# EAGLE design FTDI_PROG2 (EAGLE 5.10)
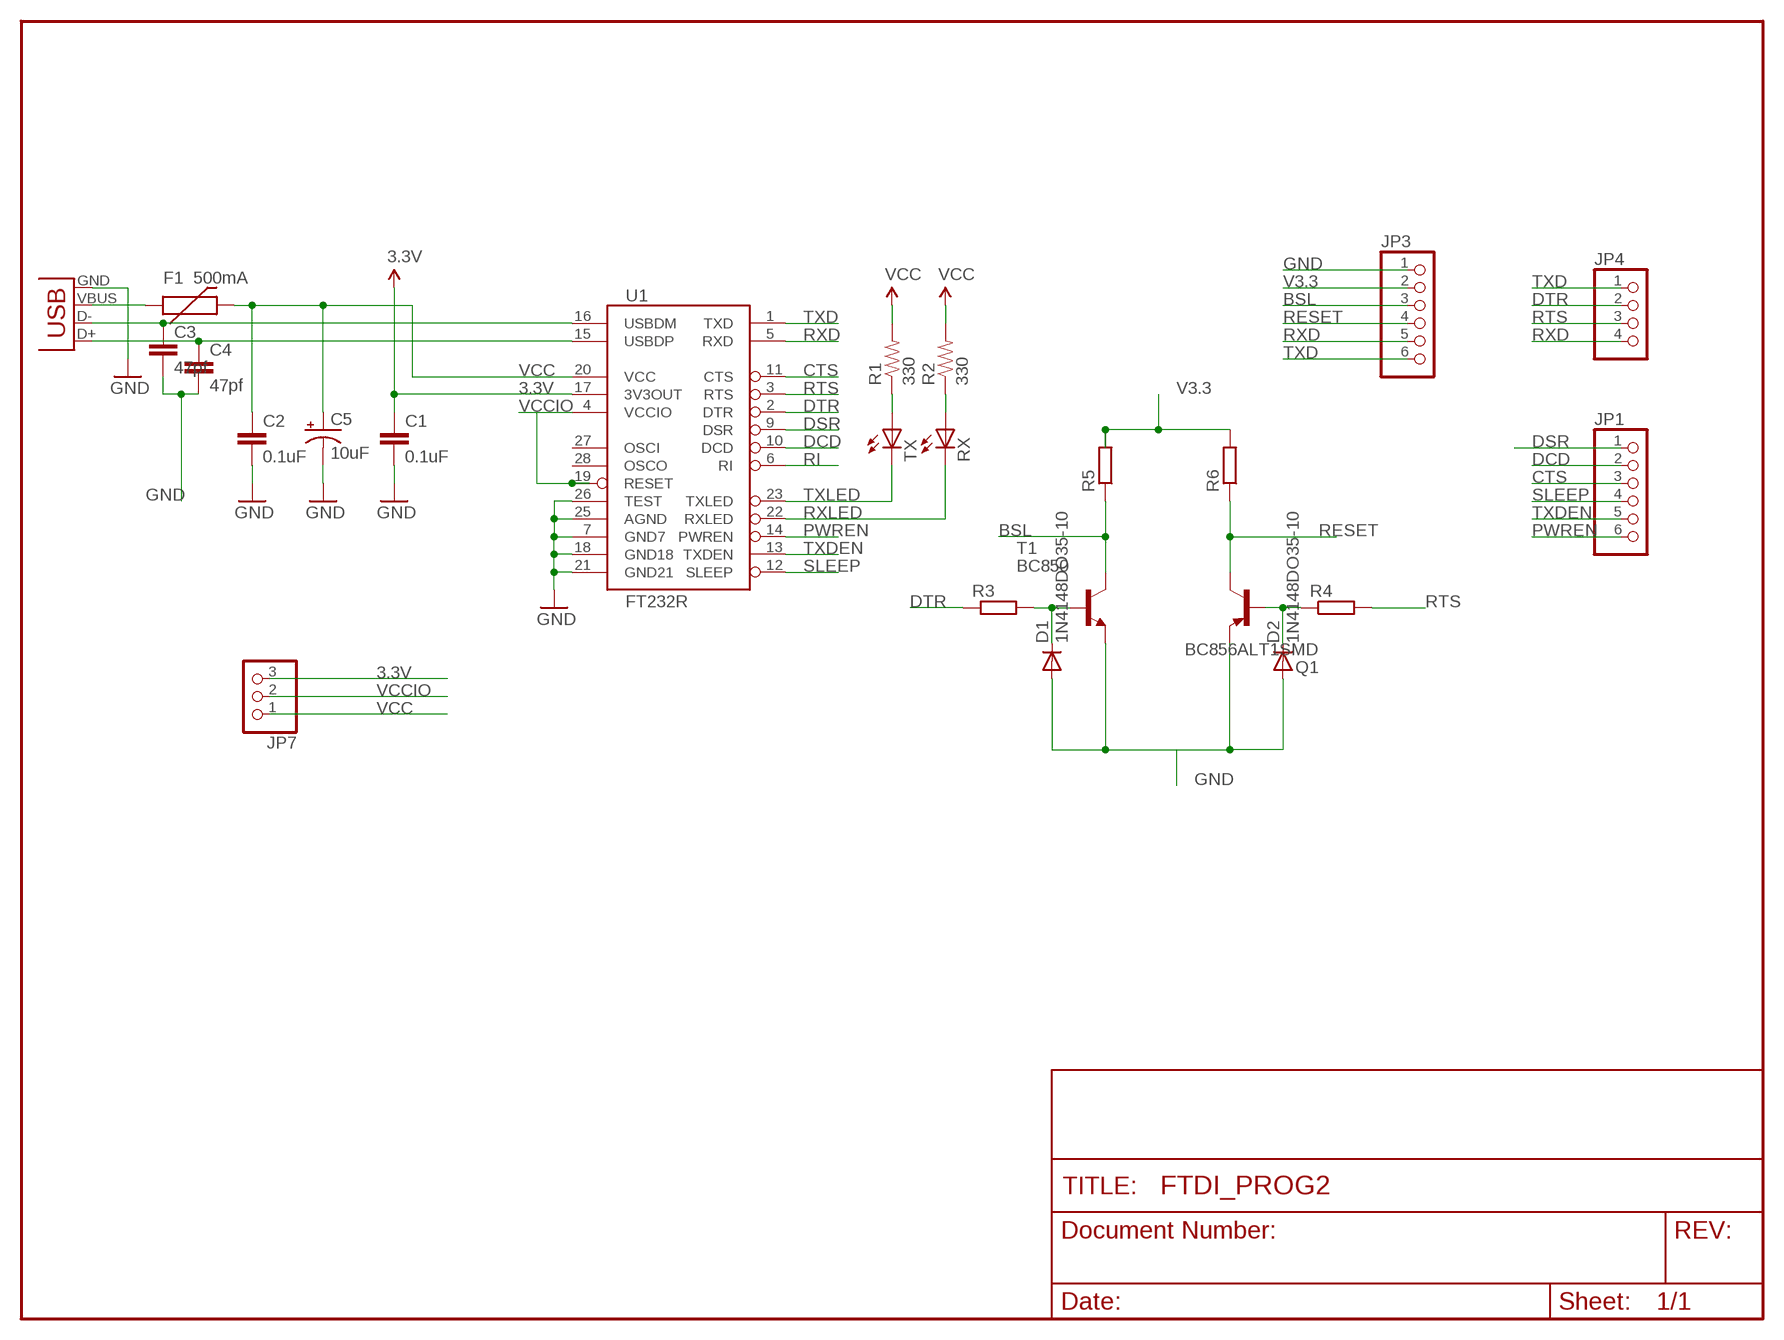
[diagram p0: schematic, sheet 1]

## Parts
C1  0.1uF  CAP1206  [1206]
C2  0.1uF  CAP1206  [1206]
C3  47pf  C-EU025-024X044  [C025-024X044]
C4  47pf  C-EU025-025X050  [C025-025X050]
C5  10uF  CAP_POLPTH1  [CPOL-RADIAL-100UF-25V]
D1  1N4148DO35-10  [DO35-10]
D2  1N4148DO35-10  [DO35-10]
F1  500mA  PTCSMD  [PTC-1206]
JP1  PINHD-1X6  [1X06]
JP3  PINHD-1X6  [1X06]
JP4  PINHD-1X4  [1X04]
JP7  PINHD-1X3  [1X03]
Q1  BC856ALT1SMD  [SOT23-BEC]
R1  330  RESISTOR1206  [1206]
R2  330  RESISTOR1206  [1206]
R3  R-EU_0207/10  [0207/10]
R4  R-EU_0207/10  [0207/10]
R5  R-EU_0207/10  [0207/10]
R6  R-EU_0207/10  [0207/10]
RX  LED1206  [LED-1206]
T1  BC850  [SOT23]
TX  LED1206  [LED-1206]
U1  FT232R  FT232RLSSOP  [SSOP28DB]
X2  USBPTH  [USB-B-PTH]

## Nets
3.3V [power]: C1.1 JP7.3 U1.17(3V3OUT)
BSL: JP3.3 R5.1 T1.3(C)
CTS: JP1.3 U1.11(CTS)
DCD: JP1.2 U1.10(DCD)
DSR: JP1.1 U1.9(DSR)
DTR: JP4.2 R3.1 U1.2(DTR)
GND [power]: C1.2 C2.2 C3.2 C4.2 C5.2(-) D1.A D2.A JP3.1 Q1.E T1.2(E) U1.7(GND7) U1.18(GND18) U1.21(GND21) U1.25(AGND) U1.26(TEST) X2.GND
N$1: R1.1 TX.A
N$2: R2.1 RX.A
N$3: F1.1 X2.VBUS
N$4: D1.C R3.2 T1.1(B)
N$5: D2.C Q1.B R4.1
PWREN: JP1.6 U1.14(PWREN)
RESET: JP3.4 Q1.C R6.1
RI: U1.6(RI)
RTS: JP4.3 R4.2 U1.3(RTS)
RXD: JP3.5 JP4.4 U1.5(RXD)
RXLED: RX.C U1.22(RXLED)
SLEEP: JP1.4 U1.12(SLEEP)
TXD: JP3.6 JP4.1 U1.1(TXD)
TXDEN: JP1.5 U1.13(TXDEN)
TXLED: TX.C U1.23(TXLED)
USB_D+: C4.1 U1.15(USBDP) X2.D+
USB_D-: C3.1 U1.16(USBDM) X2.D-
V3.3: JP3.2 R5.2 R6.2
VCC [power]: C2.1 C5.1(+) F1.2 JP7.1 R1.2 R2.2 U1.20(VCC)
VCCIO: JP7.2 U1.4(VCCIO) U1.19(RESET)
Unconnected: U1.27(OSCI) U1.28(OSCO)

## Library data of the parts
C1 C2 = SparkFun:CAP: Capacitor Standard 0603 ceramic capacitor, and 0.1" leaded capacitor.
C3 C4 = rcl:C-EU: CAPACITOR, European symbol
C5 = SparkFun:CAP_POL: Capacitor Polarized These are standard SMD and PTH capacitors. Normally 10uF, 47uF, and 100uF in electrolytic and tantalum varieties. Always verify the external diameter of the through hole cap, it varies with capacity, voltage, and manufacturer. The EIA devices should be standard.
D1 D2 = diode:1N4148: DIODE high speed (Philips)
F1 = SparkFun:PTC: Resettable Fuse PTC Resettable Fuse. Spark Fun Electronics SKU : COM-08357
JP1 JP3 = pinhead:PINHD-1X6: PIN HEADER
JP4 = pinhead:PINHD-1X4: PIN HEADER
JP7 = pinhead:PINHD-1X3: PIN HEADER
Q1 = transistor-pnp:BC856*: PNP Transistror
R1 R2 = SparkFun:RESISTOR: Resistor Basic schematic elements and footprints for 0603, 1206, and PTH 1/10th watt (small) resistors.
R3-R6 = resistor:R-EU_: RESISTOR, European symbol
RX TX = SparkFun:LED: LEDs Standard schematic elements and footprints for 5mm, 3mm, 1206, and 0603 sized LEDs. 5mm - Spark Fun Electronics SKU : COM-00529 (and others)
T1 = transistor:BC850: NPN TRANSISTOR
U1 = SparkFun:FT232RL: USB UART FT232RL 4th Generation USB UART (USB <-> Serial) Controller. Spark Fun Electronics SKU : COM-00650
X2 = SparkFun:USB: USB Connectors USB-B-PTH is fully proven SKU : PRT-00139 USB-miniB is fully proven SKU : PRT-00587 USB-A-PCB is untested. USB-A-H is throughly reviewed, but untested. Spark Fun Electronics SKU : PRT-00437 USB-B-SMT is throughly reviewed, but untested. Needs silkscreen touching up. USB-A-S has not been used/tested USB-MB-H has not been used/tested

## Net classes
0 default: width 0.203 mm
1 power: width 0.254 mm

## Board
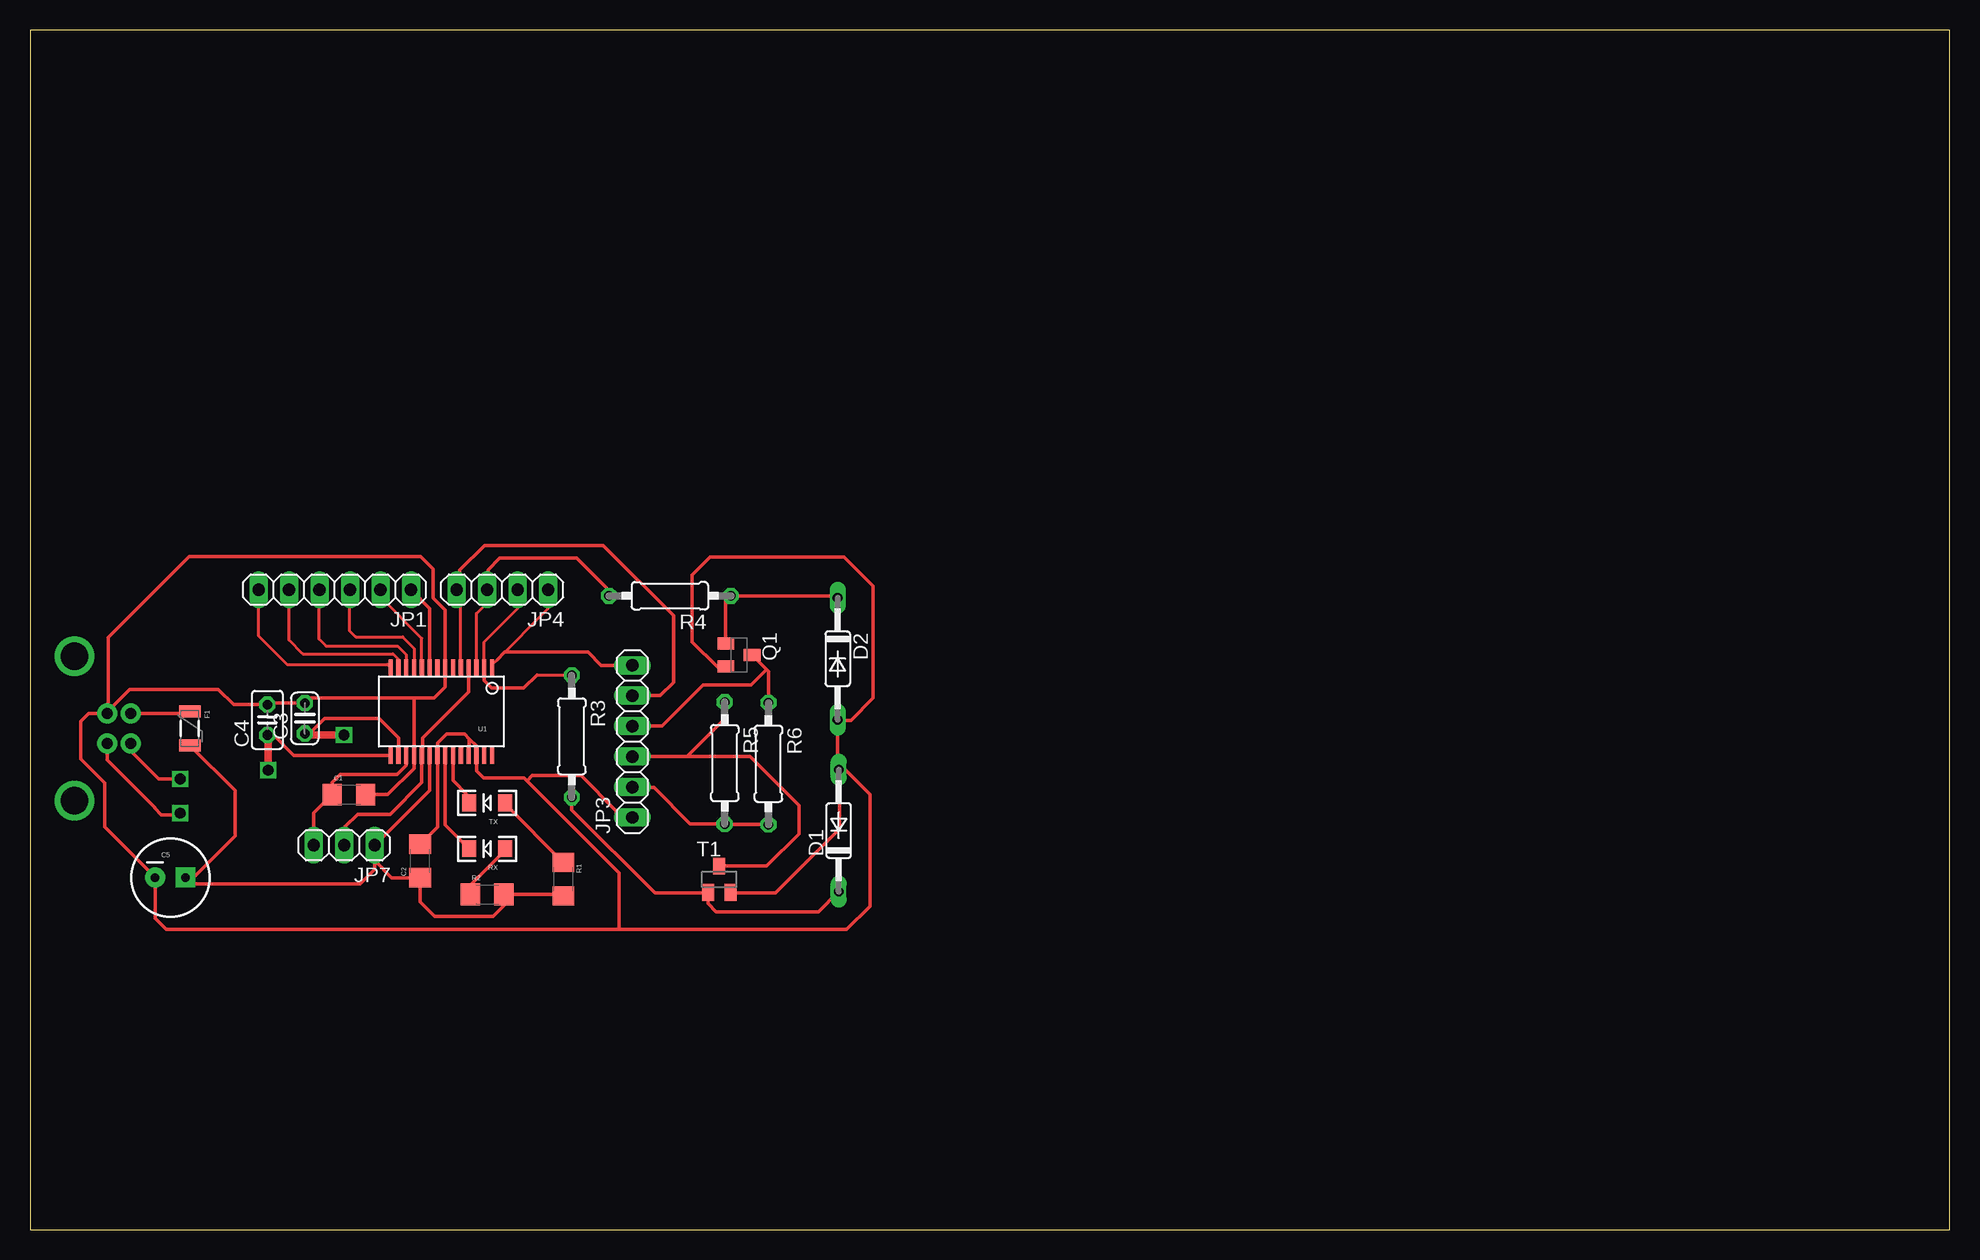
[diagram p1: board, top side]
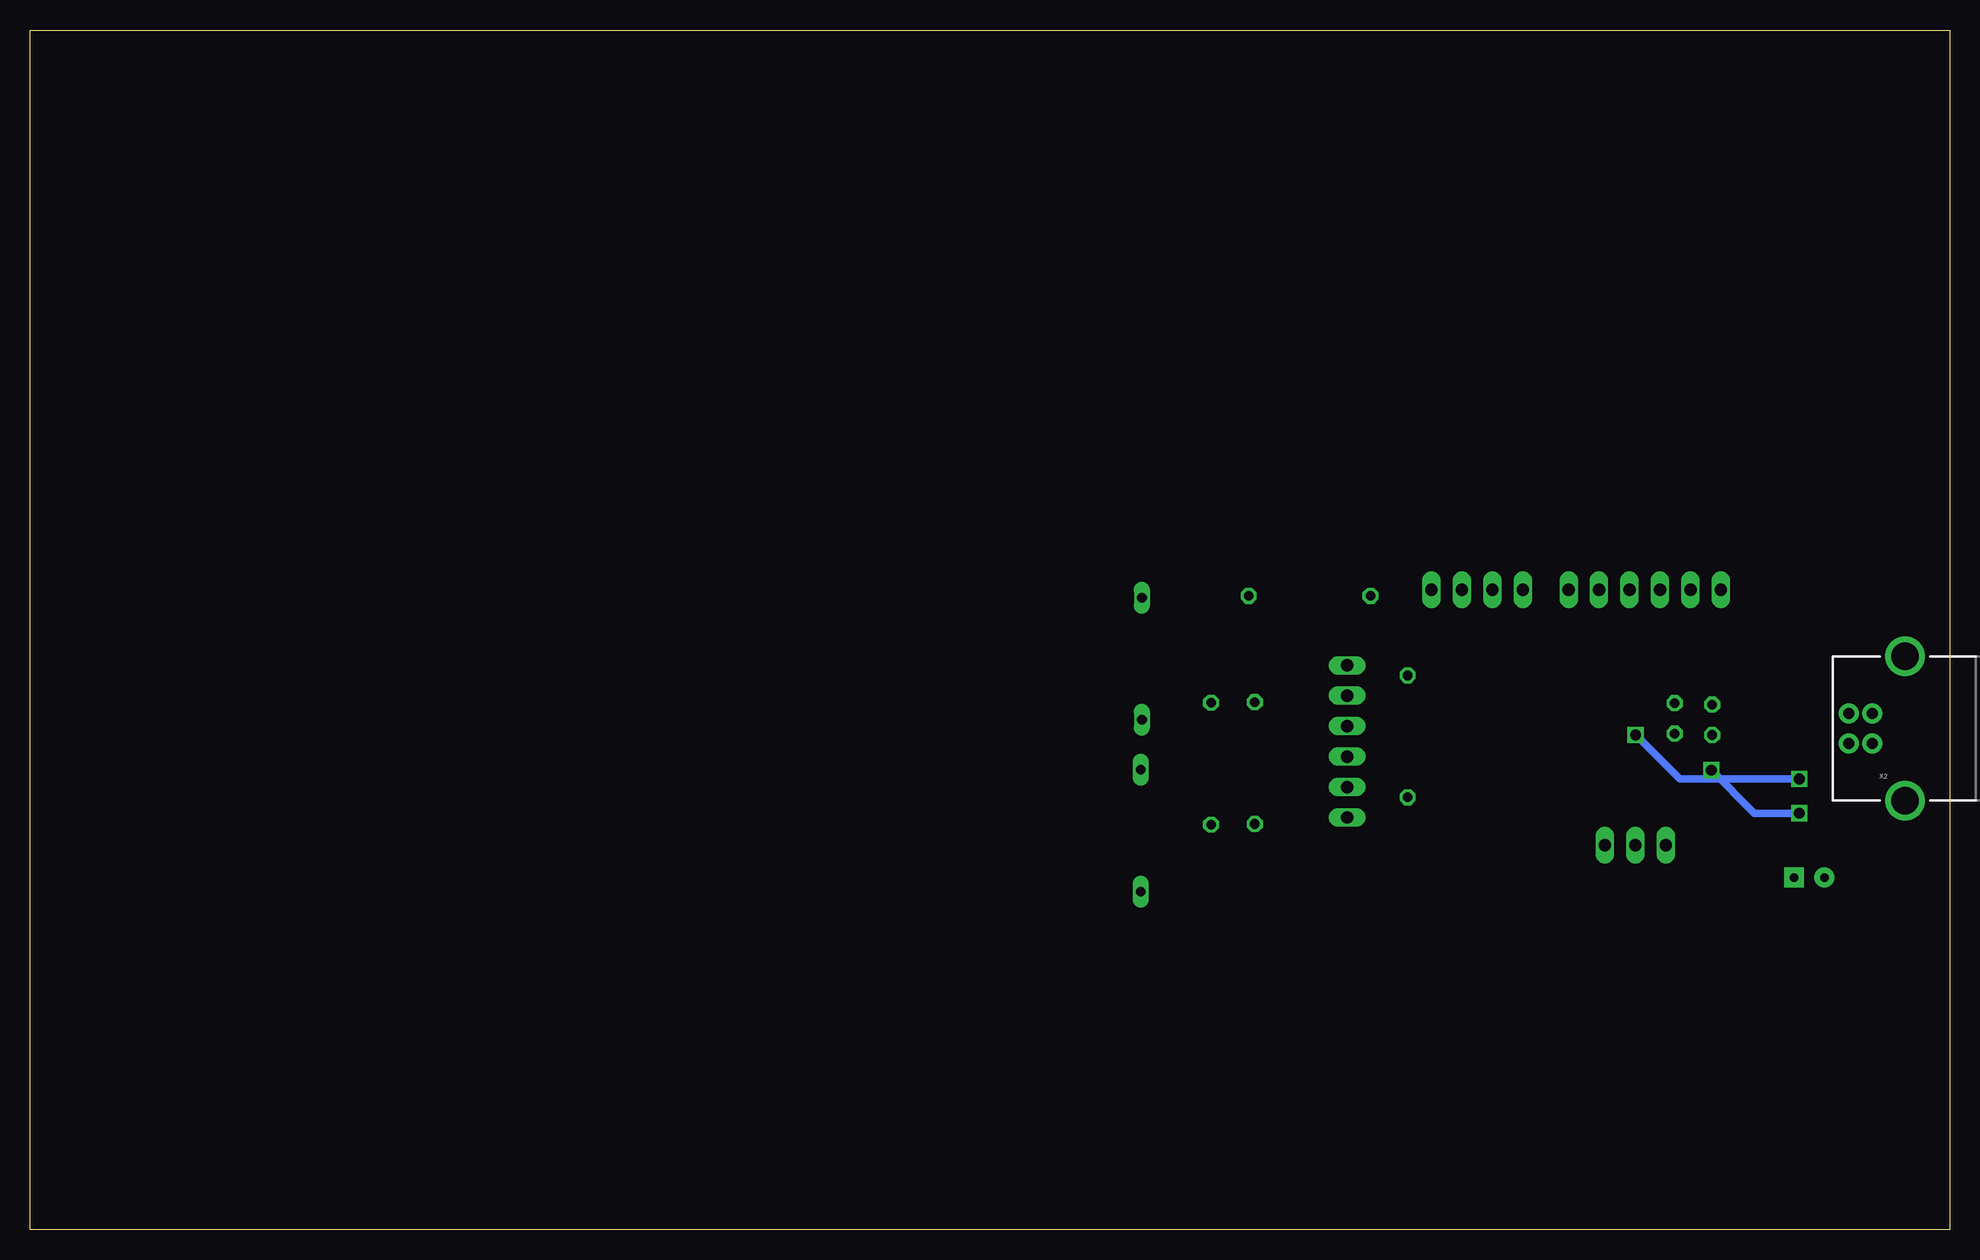
[diagram p2: board, bottom side, seen from below]

Size 160 x 100 mm. Coordinates in mm from the lower left corner, seen from the top.
Outline: 0,0 160,0 160,100 0,100 0,0
Copper layers (1*16): Top 0.035mm / dielectric 1.5mm / Bottom 0.035mm
Design rules "default": minimum track width 10mil, minimum drill 24mil, track to track 8mil, track to pad 8mil, pad to pad 8mil, via to via 8mil, smd to smd 8mil, copper to edge 40mil, drill to drill 8mil, minimum pad ring 10mil, minimum via ring 8mil, stop-mask expansion 4mil, vias tented up to drill 0mil, thermal gap 10mil

### Footprints (pad centres in the part's own frame; a part is rotated, then mirrored left to right if it is on the bottom)
1206 = smd 1.6 x 1.8: 1 -1.4,0; 2 1.4,0
C025-024X044 = drill 0.813 octagon: 1 -1.27,0; 2 1.27,0
C025-025X050 = drill 0.813 octagon: 1 -1.27,0; 2 1.27,0
CPOL-RADIAL-100UF-25V = drill 0.7 pad 1.651 square: 1 1.27,0 | drill 0.7 pad 1.651 round: 2 -1.27,0
DO35-10 = drill 0.813 long: A 5.08,0; C -5.08,0
PTC-1206 = smd 1 x 1.8: 1 -1.4,0; 2 1.4,0
1X06 = drill 1.016 long: 1 -6.35,0; 2 -3.81,0; 3 -1.27,0; 4 1.27,0; 5 3.81,0; 6 6.35,0
1X04 = drill 1.016 long: 1 -3.81,0; 2 -1.27,0; 3 1.27,0; 4 3.81,0
1X03 = drill 1.016 long: 1 -2.54,0; 2 0,0; 3 2.54,0
SOT23-BEC = smd 1 x 1.4: B -0.95,-1.1; C 0,1.1; E 0.95,-1.1
0207/10 = drill 0.813 octagon: 1 -5.08,0; 2 5.08,0
LED-1206 = smd 1.2 x 1.4: A -1.5,0; C 1.5,0
SOT23 = smd 1 x 1.4: 1 -0.95,-1.1; 2 0.95,-1.1; 3 0,1.1
SSOP28DB = smd 0.348 x 1.397: 1 -4.225,-3.656; 2 -3.575,-3.656; 3 -2.925,-3.656; 4 -2.275,-3.656; 5 -1.625,-3.656; 6 -0.975,-3.656; 7 -0.325,-3.656; 8 0.325,-3.656; 9 0.975,-3.656; 10 1.625,-3.656; 11 2.275,-3.656; 12 2.925,-3.656; 13 3.575,-3.656; 14 4.225,-3.656; 15 4.225,3.656; 16 3.575,3.656; 17 2.925,3.656; 18 2.275,3.656; 19 1.625,3.656; 20 0.975,3.656; 21 0.325,3.656; 22 -0.325,3.656; 23 -0.975,3.656; 24 -1.625,3.656; 25 -2.275,3.656; 26 -2.925,3.656; 27 -3.575,3.656; 28 -4.225,3.656
USB-B-PTH = drill 0.914 pad 1.676 round: D+ 0,1.25; D- 1.981,1.25; GND 0,-1.25; VBUS 1.981,-1.25 | drill 2.286 round: P$1 -2.718,-6.02; P$2 -2.718,6.02

### Placement (x,y rotation side)
C1  26.59,36.26 0 top
C2  32.52,30.73 90 top
C3  22.91,42.61 90 top
C4  19.79,42.49 90 top
C5  11.7,29.35 0 top
D1  67.41,33.25 90 top
D2  67.32,47.59 270 top
F1  13.32,41.77 270 top
JP1  25.4,53.34 180 top
JP3  50.21,40.69 90 top
JP4  39.37,53.34 180 top
JP7  26.19,32.04 180 top
Q1  59.09,47.89 270 top
R1  44.45,29.21 270 top
R2  38.1,27.94 0 top
R3  45.16,41.11 270 top
R4  53.34,52.83 180 top
R5  57.91,38.89 270 top
R6  61.55,38.84 270 top
RX  38.1,31.75 180 top
T1  57.45,29.19 0 top
TX  38.1,35.56 180 top
U1  34.29,43.18 180 top
X2  6.42,41.77 180 bottom

### Tracks (layer width: path | path; a pad name or v marks a point on that pad's centre or on a via)
3.3V
  Top 0.305: JP7.3 23.65,34.72 C1.1 25.2,36.28 25.2,37.29 25.84,37.93 30.6,37.93 31.36,38.69 U1.17
BSL
  Top 0.305: R5.1 57.99,43.88 57.99,42.66 54.75,39.42 JP3.3 60.03,39.42 64.11,35.34 64.11,32.99 61.41,30.3 T1.3
CTS
  Top 0.254: U1.11 32.02,48.45 31.07,49.4 27.15,49.4 26.64,49.91 26.64,53.31 JP1.3
DCD
  Top 0.254: U1.10 32.66,49.27 29.22,52.72 29.22,53.33 JP1.2
DSR
  Top 0.305: JP1.1 33.31,51.77 U1.9
DTR
  Top 0.254: U1.2 37.87,48.99 40.68,51.8 40.68,53.3 JP4.2
  Top 0.305: R3.1 42.25,46.24 41.16,45.15 38.47,45.15 37.86,45.76 37.86,46.83 U1.2
GND
  Top 0.305: Q1.E 57.26,46.94 55.2,48.99 55.2,54.55 56.7,56.05 67.87,56.05 70.27,53.65 70.27,44.29 68.42,42.45 67.38,42.45 D2.A 67.32,38.42 D1.A | T1.2 58.44,28.05 62.13,28.05 67.49,33.42 67.49,38.25 D1.A | 36.62,40.91 36.22,41.31 34.72,41.31 33.97,40.56 U1.21 33.97,33.57 C2.2 | 36.62,40.91 36.62,39.58 U1.25 | 36.62,40.91 37.22,40.31 U1.26 37.22,38.25 37.8,37.66 41.18,37.66 41.44,37.41 | C1.2 29.82,36.26 32.02,38.46 U1.18 32.02,39.53 32.02,44.31 | JP3.1 50.12,34.25 48.88,34.25 48.88,34.9 45.93,37.84 41.87,37.84 41.44,37.41 | D1.A 67.92,38.33 70,36.25 70,26.93 68.08,25.01 49.12,25.01 | 49.12,25.01 11.35,25.01 10.43,25.93 C5.2 6.21,33.56 6.21,37.22 4.21,39.23 4.21,42.36 4.88,43.02 X2.GND 6.53,43.13 6.53,49.34 13.29,56.09 32.58,56.09 33.61,55.06 33.61,52.64 34.62,51.63 U1.7 34.62,45.22 33.7,44.31 32.02,44.31 | 32.02,44.31 23.34,44.31 C3.2 19.91,43.88 C4.2 16.97,43.76 15.71,45.03 8.32,45.03 6.52,43.23 6.52,42.99 | 41.44,37.41 49.12,29.73 49.12,25.01
N$1
  Top 0.305: TX.A 39.6,35.46 R1.1
N$2
  Top 0.305: RX.A 39.6,31.59 36.64,28.63 36.64,28 R2.1
N$3
  Top 0.305: X2.VBUS 13.17,43.02 F1.1
N$4
  Top 0.305: D1.C 65.73,26.49 57.18,26.49 56.5,27.17 T1.1 56.48,28.07 52.09,28.07 45.16,34.99 R3.2
N$5
  Top 0.305: D2.C 67.16,52.83 R4.1 57.99,52.4 Q1.B
PWREN
  Top 0.254: JP1.6 19.05,49.5 21.43,47.12 29.78,47.12 U1.14
RESET
  Top 0.305: 61.38,46.7 Q1.C | 61.38,46.7 61.55,46.53 R6.1 | JP3.4 52.67,41.96 56.11,45.4 60.09,45.4 61.38,46.7
RTS
  Top 0.254: U1.3 37.22,51.37 38.12,52.28 | 38.12,53.31 JP4.3
  Top 0.305: 38.12,52.28 38.12,53.31 | R4.2 48.26,53.28 45.58,55.96 39.17,55.96 38.19,54.98 38.19,53.42 JP4.3
RXD
  Top 0.254: U1.5 35.91,52.98 JP4.4
  Top 0.305: JP3.5 52.52,44.5 53.63,45.61 53.63,51.2 47.78,57.04 37.88,57.04 35.83,54.99 35.83,53.61 JP4.4
RXLED
  Top 0.305: U1.22 34.62,33.73 RX.C
SLEEP
  Top 0.254: U1.12 31.36,47.92 30.65,48.63 24.67,48.63 24.09,49.22 24.09,53.3 JP1.4
TXD
  Top 0.254: U1.1 38.52,47.09 38.92,47.49 43.18,51.75 JP4.1
  Top 0.305: JP3.6 47.62,47.04 46.53,48.14 39.56,48.14 38.92,47.49
TXDEN
  Top 0.254: U1.13 30.71,47.53 30.26,47.99 22.74,47.99 21.6,49.13 JP1.5
TXLED
  Top 0.305: U1.23 35.27,37.44 36.5,36.21 36.5,35.66 TX.C
USB_D+  (via drill 0.9)
  Top 0.305: C4.1 20.3,41.22 21.98,39.54 30.05,39.54 U1.15 | X2.D+ 6.42,39.14 10.39,35.17 10.39,35.13 10.95,34.57 12.4,34.57 v12.53,34.7
  Top 0.61: v19.84,38.3 19.84,41.16 C4.1
  Bottom 0.61: v12.53,34.7 16.25,34.7 v19.84,38.3
USB_D-  (via drill 0.9)
  Top 0.305: X2.D- 8.4,39.9 10.73,37.57 v12.53,37.57 | C3.1 23.32,41.34 24.57,42.59 29.12,42.59 30.72,41 U1.16
  Top 0.61: v26.16,41.23 23.02,41.23 C3.1
  Bottom 0.61: v12.53,37.57 22.5,37.57 v26.16,41.23
V3.3
  Top 0.305: R6.2 57.96,33.76 R5.2 55.04,33.81 52,36.84 50.25,36.84 JP3.2
VCC
  Top 0.305: R1.2 44.32,27.94 R2.2 39.49,27 38.6,26.11 33.73,26.11 32.52,27.32 C2.1 30.16,29.33 28.73,30.75 | U1.20 33.31,36.62 JP7.1 28.73,30.75 | 28.73,30.75 28.73,30.02 27.51,28.8 13.51,28.8 C5.1 13.64,29.35 17.11,32.82 17.11,36.59 F1.2 12.97,40.02
VCCIO
  Top 0.305: U1.4 36.56,44.81 32.72,40.96 32.72,39.58 U1.19 32.66,37.25 30.04,34.62 27.29,34.62 26.25,33.58 26.25,32.1 JP7.2